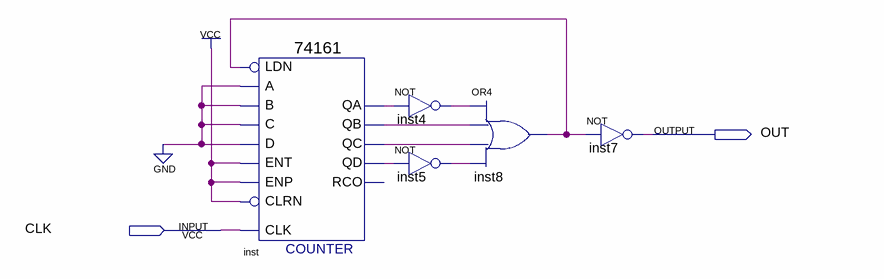
[diagram p0: schematic sheet]
// Quartus schematic Modulo10_74161_Syn.bdf as structural Verilog: 5 symbols, 2 pins
module Modulo10_74161_Syn (
  input  CLK,
  output OUT
);

  wire inst4_out, inst5_out, inst8_out, inst_qa, inst_qb, inst_qc, inst_qd;

  \74161  inst (
    .CLRN(1'b1), .CLK(CLK), .ENP(1'b1), .LDN(inst8_out), .A(1'b0), .D(1'b0), .ENT(1'b1), .B(1'b0), .C(1'b0),
    .QD(inst_qd), .QC(inst_qc), .QB(inst_qb), .QA(inst_qa));  // open: RCO
  not inst4 (inst4_out, inst_qa);
  not inst5 (inst5_out, inst_qd);
  or inst8 (inst8_out, inst4_out, inst_qb, inst_qc, inst5_out);
  not inst7 (OUT, inst8_out);
endmodule
